# EAGLE schematic energymetter_labsi (EAGLE 9.6.2)
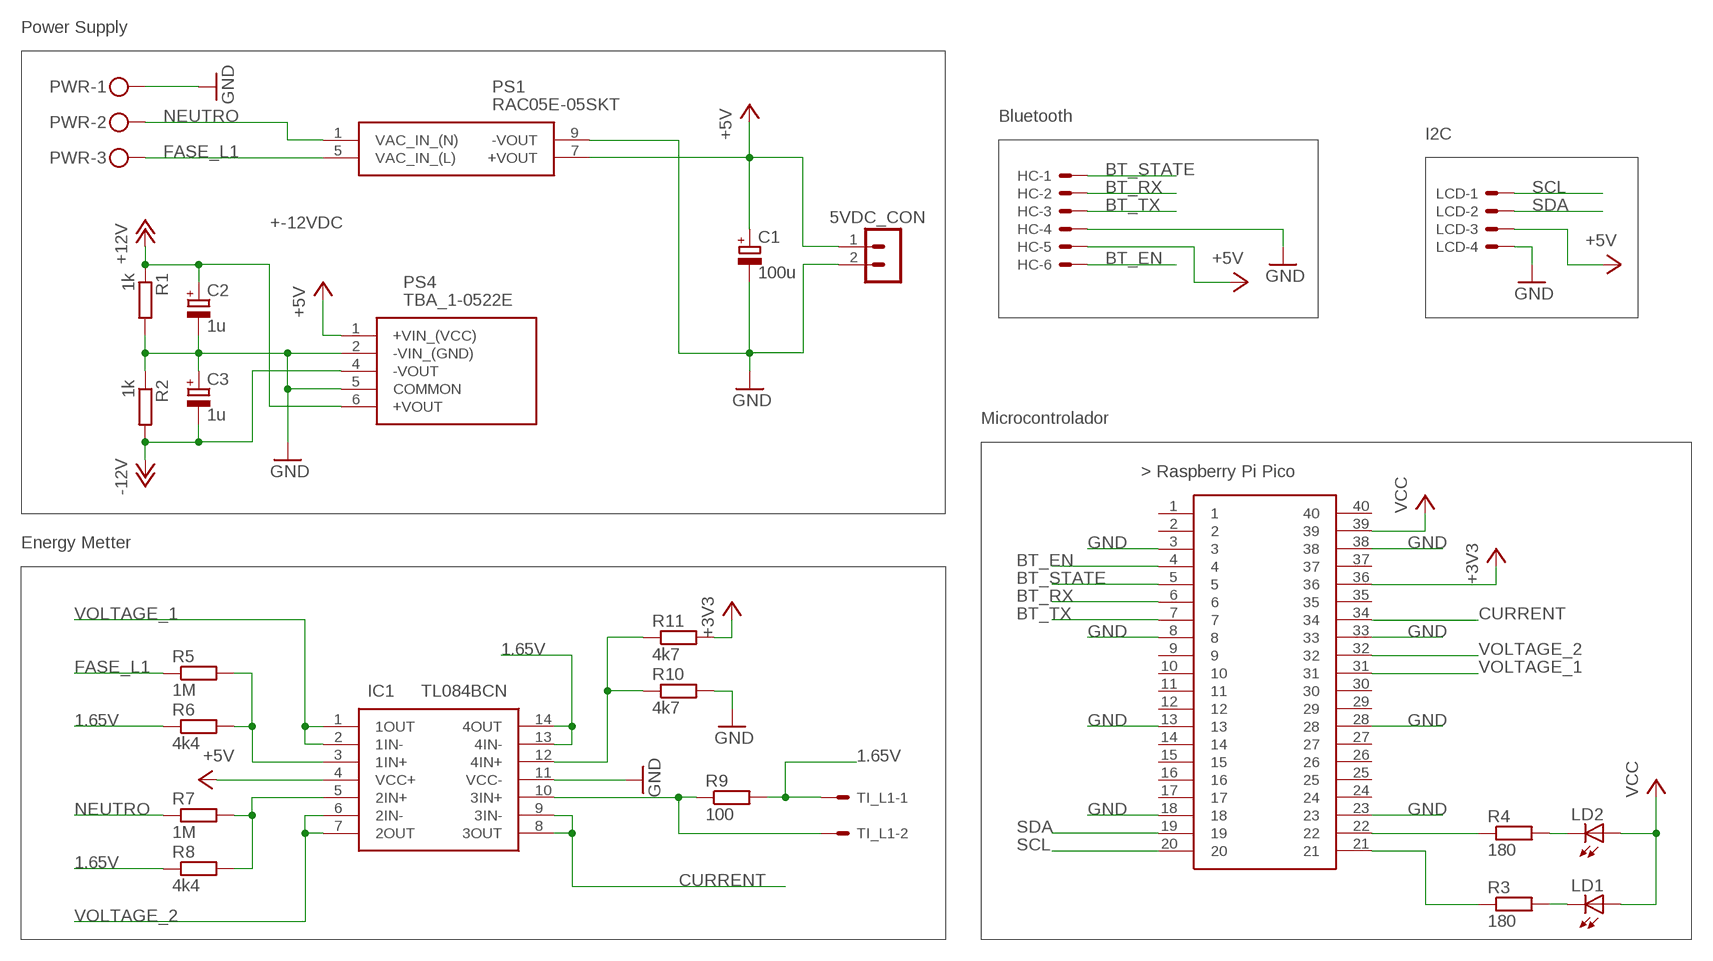
[diagram p0: schematic, sheet 1]

## Parts
5VDC_CON  MA02-1  [MA02-1]
C1  100u  CPOL-EUE2-5  [E2-5]
C2  1u  CPOL-EUE2-5  [E2-5]
C3  1u  CPOL-EUE2-5  [E2-5]
HC  22-23-2061  [22-23-2061]
IC1  TL084BCN  [DIP794W53P254L1930H508Q14N]
LCD  Display  22-23-2041  [22-23-2041]
LD1  LED5MM  [LED5MM]
LD2  LED5MM  [LED5MM]
PS1  RAC05E-05SKT  [RAC05E05SKT]
PS4  TBA_1-0522E  [TBA10522E]
PWR  MKDSN1,5/3-5,08  [MKDSN1,5/3-5,08]
R1  1k  R-EU_0204/7  [0204/7]
R2  1k  R-EU_0204/7  [0204/7]
R3  180  R-EU_0204/7  [0204/7]
R4  180  R-EU_0204/7  [0204/7]
R5  1M  R-EU_0204/7  [0204/7]
R6  4k4  R-EU_0204/7  [0204/7]
R7  1M  R-EU_0204/7  [0204/7]
R8  4k4  R-EU_0204/7  [0204/7]
R9  100  R-EU_0204/7  [0204/7]
R10  4k7  R-EU_0204/7  [0204/7]
R11  4k7  R-EU_0204/7  [0204/7]
TI_L1  22-23-2021  [22-23-2021]
U$1  RASPBERRY-PI-PICO_TH  [FT_RASPBERRY-PI-PICO_TH]

## Nets
1.65V: IC1.13(4IN-) IC1.14(4OUT) R6.1 R8.1 R9.2 TI_L1.1
+3V3: R11.2 U$1.36
+5V: 5VDC_CON.1 C1.+ HC.5 IC1.4(VCC+) LCD.3 PS1.7(+VOUT) PS4.1(+VIN_(VCC))
+12V: C2.+ PS4.6(+VOUT) R1.1
-12V: C3.- PS4.4(-VOUT) R2.2
BT_EN: HC.6 U$1.4
BT_RX: HC.2 U$1.6
BT_STATE: HC.1 U$1.5
BT_TX: HC.3 U$1.7
CURRENT: IC1.8(3OUT) IC1.9(3IN-) U$1.34
FASE_L1: PS1.5(VAC_IN_(L)) PWR.3 R5.1
GND: 5VDC_CON.2 C1.- C2.- C3.+ HC.4 IC1.11(VCC-) LCD.4 PS1.9(-VOUT) PS4.2(-VIN_(GND)) PS4.5(COMMON) PWR.1 R1.2 R2.1 R10.2 U$1.3 U$1.8 U$1.13 U$1.18 U$1.23 U$1.28 U$1.33 U$1.38
N$1: R4.1 U$1.22
N$2: R3.1 U$1.21
N$3: LD1.K(C) R3.2
N$4: LD2.K(C) R4.2
N$5: IC1.10(3IN+) R9.1 TI_L1.2
N$11: IC1.3(1IN+) R5.2 R6.2
N$12: IC1.5(2IN+) R7.2 R8.2
N$28: IC1.12(4IN+) R10.1 R11.1
NEUTRO: PS1.1(VAC_IN_(N)) PWR.2 R7.1
SCL: LCD.1 U$1.20
SDA: LCD.2 U$1.19
VCC: LD1.A LD2.A U$1.39
VOLTAGE_1: IC1.1(1OUT) IC1.2(1IN-) U$1.31
VOLTAGE_2: IC1.6(2IN-) IC1.7(2OUT) U$1.32
Unconnected: U$1.1 U$1.2 U$1.9 U$1.10 U$1.11 U$1.12 U$1.14 U$1.15 U$1.16 U$1.17 U$1.24 U$1.25 U$1.26 U$1.27 U$1.29 U$1.30 U$1.35 U$1.37 U$1.40

## Notes on the sheet
- Power Supply
- Bluetooth
- I2C
- +-12VDC
- Microcontrolador
- Energy Metter

## Library data of the parts
5VDC_CON = con-lstb1:MA02-1
C1-C3 = rcl:CPOL-EU: POLARIZED CAPACITOR, European symbol; SPICEPREFIX: C
HC = con-molex:22-23-2061: .100" (2.54mm) Center Header - 6 Pin; MF: MOLEX; MPN: 22-23-2061; OC_FARNELL: 1462922; OC_NEWARK: 27C1933
IC1 = TL084BCN:TL084BCN: Quad JFET-input low offset operational amplifier Source: Datasheet <http://componentsearchengine.com/Datasheets/1/TL084BCN.pdf>; ARROW_PART_NUMBER: TL084BCN; ARROW_PRICE-STOCK: https://www.arrow.com/en/products/tl084bcn/texas-instruments; DESCRIPTION: Quad JFET-input low offset operational amplifier; HEIGHT: 5.08mm; MANUFACTURER_NAME: Texas Instruments; MANUFACTURER_PART_NUMBER: TL084BCN; MOUSER_PART_NUMBER: 595-TL084BCN; MOUSER_PRICE-STOCK: https://www.mouser.co.uk/ProductDetail/Texas-Instruments/TL084BCN?qs=OorDGPQ79Eq%2Fg0D%252BtqqP7Q%3D%3D
LCD = con-molex:22-23-2041: .100" (2.54mm) Center Header - 4 Pin; MF: MOLEX; MPN: 22-23-2041; OC_FARNELL: 1462920; OC_NEWARK: 38C0355
LD1 LD2 = led:LED: LED OSRAM: - CHIPLED LG R971, LG N971, LY N971, LG Q971, LY Q971, LO R971, LY R971 LH N974, LH R974 LS Q976, LO Q976, LY Q976 LO Q996 - Hyper CHIPLED LW Q18S LB Q993, LB Q99A, LB R99A - SideLED LS A670, LO A670, LY A670, LG A670, LP A670 LB A673, LV A673, LT A673, LW A673 LH A674 LY A675 LS A676, LA A676, LO A676, LY A676, LW A676 LS A679, LY A679, LG A679 - Hyper Micro SIDELED® LS Y876, LA Y876, LO Y876, LY Y876 LT Y87S - SmartLED LW L88C, LW L88S LB L89C, LB L89S, LG L890 LS L89K, LO L89K, LY L89K LS L896, LA L896, LO L896, LY L896 - TOPLED LS T670, LO T670, LY T670, LG T670, LP T670 LSG T670, LSP T670, LSY T670, LOP T670, LYG T670 LG T671, LOG T671, LSG T671 LB T673, LV T673, LT T673, LW T673 LH T674 LS T676, LA T676, LO T676, LY T676, LB T676, LH T676, LSB T676, LW T676 LB T67C, LV T67C, LT T67C, LS T67K, LO T67K, LY T67K, LW E67C LS E67B, LA E67B, LO E67B, LY E67B, LB E67C, LV E67C, LT E67C LW T67C LS T679, LY T679, LG T679 LS T770, LO T770, LY T770, LG T770, LP T770 LB T773, LV T773, LT T773, LW T773 LH T774 LS E675, LA E675, LY E675, LS T675 LS T776, LA T776, LO T776, LY T776, LB T776 LHGB T686 LT T68C, LB T68C - Hyper Mini TOPLED® LB M676 - Mini TOPLED Santana® LG M470 LS M47K, LO M47K, LY M47K Source: http://www.osram.convergy.de/
PS1 = RAC05E-05SKT:RAC05E-05SKT: 5 Watt 1.07?x1.26? Single Output, 5VDC Source: Datasheet <https://recom-power.com/pdf/Powerline_AC-DC/RAC05E-KT.pdf>; ARROW_PART_NUMBER: RAC05E-05SKT; ARROW_PRICE-STOCK: https://www.arrow.com/en/products/rac05e-05skt/recom-power?region=nac; DESCRIPTION: 5 Watt 1.07?x1.26? Single Output, 5VDC; HEIGHT: 22mm; MANUFACTURER_NAME: RECOM Power; MANUFACTURER_PART_NUMBER: RAC05E-05SKT; MOUSER_PART_NUMBER: 919-RAC05E-05SKT; MOUSER_PRICE-STOCK: https://www.mouser.co.uk/ProductDetail/RECOM-Power/RAC05E-05SKT?qs=7D1LtPJG0i1k%2FYw%252BRylc5g%3D%3D
PS4 = TBA_1-0522E:TBA_1-0522E: 1 Watt DC/DC converter, industrial, +/-10% input, short circuit protection, unregulated, encapsulated, SIP-7 Source: Datasheet <https://tracopower.com/tba1e-datasheet/>; DESCRIPTION: 1 Watt DC/DC converter, industrial, +/-10% input, short circuit protection, unregulated, encapsulated, SIP-7; HEIGHT: 10.35mm; MANUFACTURER_NAME: Traco Power; MANUFACTURER_PART_NUMBER: TBA 1-0522E; MOUSER_PART_NUMBER: 495-TBA1-0522E; MOUSER_PRICE-STOCK: https://www.mouser.co.uk/ProductDetail/TRACO-Power/TBA-1-0522E?qs=byeeYqUIh0N72%2FQSgieQ2g%3D%3D
PWR = con-phoenix-508:MKDSN1,5/3-5,08: MKDSN 1,5/ 3-5,08 Printklemme Nennstrom: 13,5 A Nennspannung: 250 V Rastermaß: 5,08 mm Polzahl: 3 Anschlussart: Schraubanschluss Montage: Löten Anschlussrichtung Leiter/Platine: 0 ° Artikelnummer: 1729131 Source: http://eshop.phoenixcontact.com .. 1729131.pdf
R1-R11 = rcl:R-EU_: RESISTOR, European symbol; SPICEPREFIX: R
TI_L1 = con-molex:22-23-2021: .100" (2.54mm) Center Header - 2 Pin; MF: MOLEX; MPN: 22-23-2021; OC_FARNELL: 1462926; OC_NEWARK: 25C3832
U$1 = pipico:RASPBERRY-PI-PICO_TH: Raspberry Pi Pico microcontroller board for through-hole mounting.